# Altium schematic sheet HIenthi.SchDoc
size 508 x 242 mm; SheetNumber: 1; SheetTotal: 1
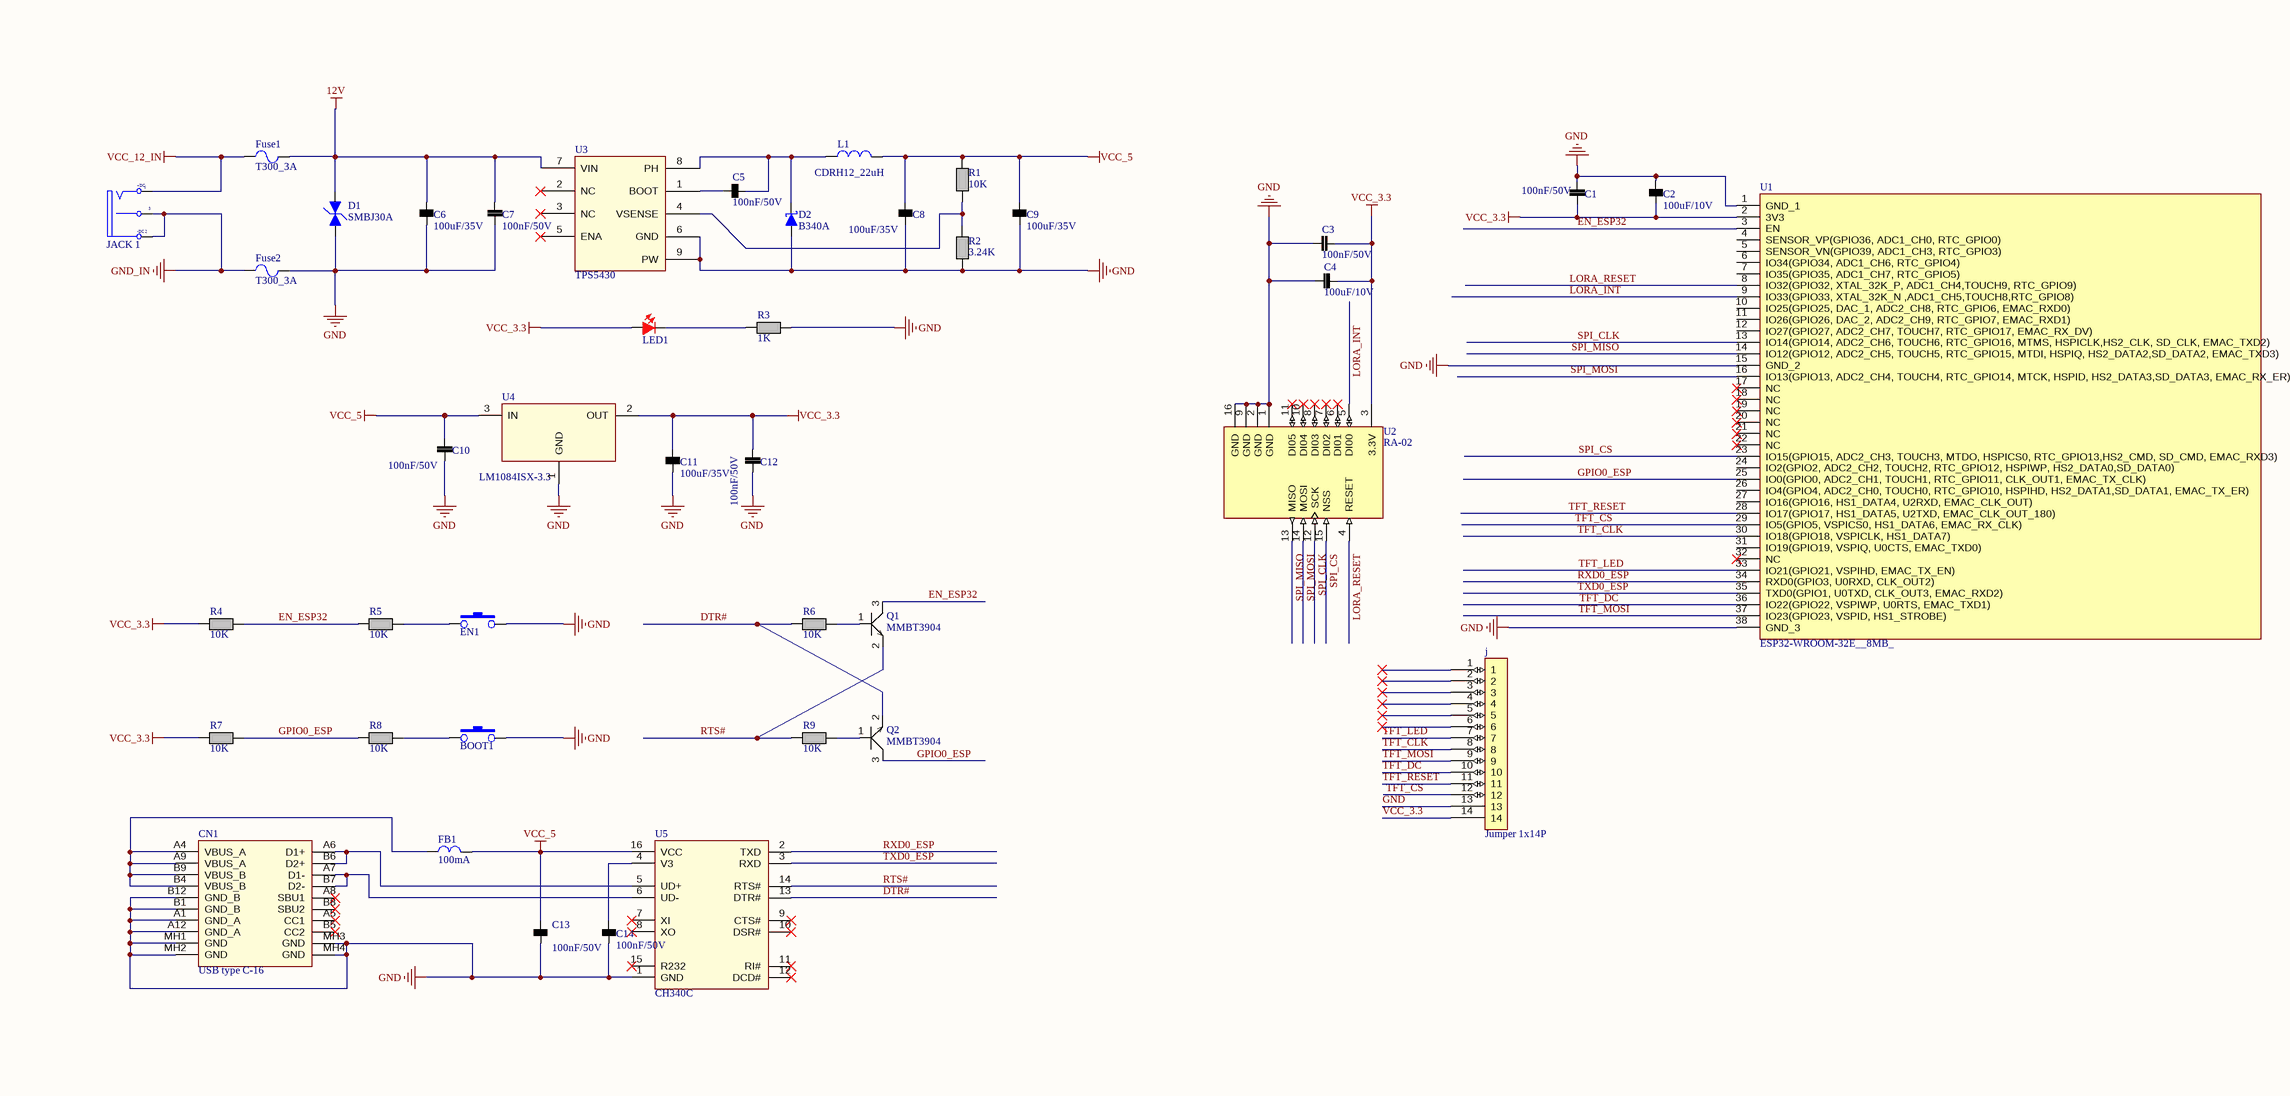
[diagram p0: HIenthi.SchDoc]

## Parts
BOOT1  SW_2pin_SMD  [SW2-SMD**]  (value not drawn)
C1  100nF/50V  [CAP-0805**]
C2  100uF/10V  [CAP_TANTA_SMD3528]
C3  100nF/50V  [CAP-0805**]
C4  100uF/10V  [CAP_TANTA_SMD3528]
C5  100nF/50V  [CAP-0805**]
C6  100uF/35V  [CAP-AL- Size D8_6.3×7.7 mm**]
C7  100nF/50V  [CAP-0805**]
C8  100uF/35V  [CAP-AL- Size D8_6.3×7.7 mm**]
C9  100uF/35V  [CAP-AL- Size D8_6.3×7.7 mm**]
C10  100nF/50V  [CAP-0805**]
C11  100uF/35V  [CAP-AL- Size D8_6.3×7.7 mm**]
C12  100nF/50V  [CAP-0805**]
C13  100nF/50V  [CAP-0805**]
C14  100nF/50V  [CAP-0805**]
CN1  USB type C-16  [USB TYPE C-16**]
D1  SMBJ30A  [DO-214AA**]
D2  B340A  [DO-214AC**]
EN1  SW_2pin_SMD  [SW2-SMD**]  (value not drawn)
FB1  100mA  [FB 0805**]
Fuse1  T300_3A  [FUSE-1812**]
Fuse2  T300_3A  [FUSE-1812**]
j  Jumper 1x14P  [JUMP1x14]
JACK_1  DC3501  [DC_005**]  (value not drawn)
L1  CDRH12_22uH  [IND_CDRH12_12x12x7MM**]
LED1  LedRed  [LED-0805-Red**]  (value not drawn)
Q1  MMBT3904  [SOT23-3 **]
Q2  MMBT3904  [SOT23-3 **]
R1  10K  [Res-0805**]
R2  3.24K  [Res-0805**]
R3  1K  [Res-0805**]
R4  10K  [Res-0805**]
R5  10K  [Res-0805**]
R6  10K  [Res-0805**]
R7  10K  [Res-0805**]
R8  10K  [Res-0805**]
R9  10K  [Res-0805**]
U1  ESP32-WROOM-32E__8MB_  [ESP32WROOM32E8MB]
U2  RA-02  [RA-02]
U3  TPS5430  [SOIC8-PAD**]
U4  LM1084ISX-3.3  [TO-263/D2PAK]
U5  CH340C  [SOIC-16**]

## Nets
12V: C6.1(+) C7.2 D1.2(A) Fuse1.2 U3.7(VIN)
GND: BOOT1.2 C1.2 C2.2(-) C3.1 C4.2(-) C6.2(-) C7.1 C8.2(-) C9.2(-) C10.1 C11.2(-) C12.1 C13.2 C14.2 CN1.A1(GND_A) CN1.A12(GND_A) CN1.B1(GND_B) CN1.B12(GND_B) CN1.MH1(GND) CN1.MH2(GND) CN1.MH3(GND) CN1.MH4(GND) D1.1(A) D2.1(A) EN1.2 Fuse2.2 j.13 R2.1 R3.1 U1.1(GND_1) U1.15(GND_2) U1.38(GND_3) U2.1(GND) U2.2(GND) U2.9(GND) U2.16(GND) U3.6(GND) U3.9(PW) U4.1(GND) U5.1(GND)
GND_IN: Fuse2.1 JACK_1.2(TN) JACK_1.3(S)
VCC_3.3: C1.1 C2.1(+) C3.2 C4.1(+) C11.1(+) C12.2 j.14 LED1.1(A) R4.2 R7.2 U1.2(3V3) U2.3(3.3V) U4.2(OUT)
VCC_5: C8.1(+) C9.1(+) C10.2 C13.1 FB1.2 L1.2 R1.2 U4.3(IN) U5.16(VCC)
VCC_12_IN: Fuse1.1 JACK_1.1(T)
DTR#: Q2.2 R6.2 U5.13(DTR#)
EN_ESP32: Q1.3 R4.1 R5.2 U1.3(EN)
GPIO0_ESP: Q2.3 R7.1 R8.2 U1.25(IO0(GPIO0,_ADC2_CH1,_TOUCH1,_RTC_GPIO11,_CLK_OUT1,_EMAC_TX_CLK))
LORA_INT: U1.9(IO33(GPIO33,_XTAL_32K_N_,ADC1_CH5,TOUCH8,RTC_GPIO8)) U2.5(DI00)
LORA_RESET: U1.8(IO32(GPIO32,_XTAL_32K_P,_ADC1_CH4,TOUCH9,_RTC_GPIO9)) U2.4(RESET)
RTS#: Q1.2 R9.2 U5.14(RTS#)
RXD0_ESP: U1.34(RXD0(GPIO3,_U0RXD,_CLK_OUT2)) U5.2(TXD)
SPI_CLK: U1.13(IO14(GPIO14,_ADC2_CH6,_TOUCH6,_RTC_GPIO16,_MTMS,_HSPICLK,HS2_CLK,_SD_CLK,_EMAC_TXD2)) U2.12(SCK)
SPI_CS: U1.23(IO15(GPIO15,_ADC2_CH3,_TOUCH3,_MTDO,_HSPICS0,_RTC_GPIO13,HS2_CMD,_SD_CMD,_EMAC_RXD3)) U2.15(NSS)
SPI_MISO: U1.14(IO12(GPIO12,_ADC2_CH5,_TOUCH5,_RTC_GPIO15,_MTDI,_HSPIQ,_HS2_DATA2,SD_DATA2,_EMAC_TXD3)) U2.13(MISO)
SPI_MOSI: U1.16(IO13(GPIO13,_ADC2_CH4,_TOUCH4,_RTC_GPIO14,_MTCK,_HSPID,_HS2_DATA3,SD_DATA3,_EMAC_RX_ER)) U2.14(MOSI)
TFT_CLK: j.8 U1.30(IO18(GPIO18,_VSPICLK,_HS1_DATA7))
TFT_CS: j.12 U1.29(IO5(GPIO5,_VSPICS0,_HS1_DATA6,_EMAC_RX_CLK))
TFT_DC: j.10 U1.36(IO22(GPIO22,_VSPIWP,_U0RTS,_EMAC_TXD1))
TFT_LED: j.7 U1.33(IO21(GPIO21,_VSPIHD,_EMAC_TX_EN))
TFT_MOSI: j.9 U1.37(IO23(GPIO23,_VSPID,_HS1_STROBE))
TFT_RESET: j.11 U1.28(IO17(GPIO17,_HS1_DATA5,_U2TXD,_EMAC_CLK_OUT_180))
TXD0_ESP: U1.35(TXD0(GPIO1,_U0TXD,_CLK_OUT3,_EMAC_RXD2)) U5.3(RXD)
NetBOOT1_1: BOOT1.1 R8.1
NetC5_1: C5.1 U3.1(BOOT)
NetC5_2: C5.2 D2.2(K) L1.1 U3.8(PH)
NetC14_1: C14.1 U5.4(V3)
NetCN1_A4: CN1.A4(VBUS_A) CN1.A9(VBUS_A) CN1.B4(VBUS_B) CN1.B9(VBUS_B) FB1.1
NetCN1_A6: CN1.A6(D1+) CN1.B6(D2+) U5.5(UD+)
NetCN1_A7: CN1.A7(D1-) CN1.B7(D2-) U5.6(UD-)
NetEN1_1: EN1.1 R5.1
NetLED1_2: LED1.2(K) R3.2
NetQ1_1: Q1.1 R6.1
NetQ2_1: Q2.1 R9.1
NetR1_1: R1.1 R2.2 U3.4(VSENSE)

Not connected (* = marked no-connect by the designer): CN1 A5(CC1)* A8(SBU1)* B5(CC2)* B8(SBU2)*; j 1* 2* 3* 4* 5* 6*; U1 4(SENSOR_VP(GPIO36,_ADC1_CH0,_RTC_GPIO0)) 5(SENSOR_VN(GPIO39,_ADC1_CH3,_RTC_GPIO3)) 6(IO34(GPIO34,_ADC1_CH6,_RTC_GPIO4)) 7(IO35(GPIO35,_ADC1_CH7,_RTC_GPIO5)) 10(IO25(GPIO25,_DAC_1,_ADC2_CH8,_RTC_GPIO6,_EMAC_RXD0)) 11(IO26(GPIO26,_DAC_2,_ADC2_CH9,_RTC_GPIO7,_EMAC_RXD1)) 12(IO27(GPIO27,_ADC2_CH7,_TOUCH7,_RTC_GPIO17,_EMAC_RX_DV)) 17(NC)* 18(NC)* 19(NC)* 20(NC)* 21(NC)* 22(NC)* 24(IO2(GPIO2,_ADC2_CH2,_TOUCH2,_RTC_GPIO12,_HSPIWP,_HS2_DATA0,SD_DATA0)) 26(IO4(GPIO4,_ADC2_CH0,_TOUCH0,_RTC_GPIO10,_HSPIHD,_HS2_DATA1,SD_DATA1,_EMAC_TX_ER)) 27(IO16(GPIO16,_HS1_DATA4,_U2RXD,_EMAC_CLK_OUT)) 31(IO19(GPIO19,_VSPIQ,_U0CTS,_EMAC_TXD0)) 32(NC)*; U2 6(DI01)* 7(DI02)* 8(DI03)* 10(DI04)* 11(DI05)*; U3 2(NC)* 3(NC)* 5(ENA)*; U5 7(XI)* 8(XO)* 9(CTS#)* 10(DSR#)* 11(RI#)* 12(DCD#)* 15(R232)*

## Notes on the sheet
- (in symbol Jack  DC3501) +DC; -DC

## Library data of the parts
C1 C3 C5 C7 C10 C12-C14 = Cap-100nF/50V_0805: 2Pin-SMD-0805 ,Ceramic X7R; ComponentLink2Description: LINK; ComponentLink2URL: https://detail.tmall.com/item.htm?spm=a230r.1.14.4.26821280N1IkGr&id=14263740089&ns=1&abbucket=13; Supplier 1: Digi-Key; Supplier Part Number 1: 478-5794-1-ND
C2 C4 = Cap-Tanta_100uF/10V 3528: Cap-Tantalum  SMD3528 3.5mm x 2.8mm; ComponentLink1Description: LINK; ComponentLink1URL: https://www.linhkienchatluong.vn/tu-tantalium/tu-tantalum-3528-107a-10v-100uf-35x28mm-tajb107m010rnj_sp460_ct1163.aspx
C6 C8 C9 C11 = Cap-Al_100uF/35V: Cap-Al-Size D8_6.3×7.7 mm; ComponentLink1Description: LINK; ComponentLink1URL: https://detail.tmall.com/item.htm?id=41255381063&ali_refid=a3_430620_1006:1109983619:N:mR14IaEyJGx9IXgn9mrJ8g==:fcc8671f3f0767a2a283883aff17c2c8&ali_trackid=1_fcc8671f3f0767a2a283883aff17c2c8&spm=a230r.1.14.11; Supplier 1: Digi-Key; Supplier Part Number 1: PCE4023CT-ND
CN1 = USB type C-16: MF: Valcon; MP: CSP-USC16-TR; SnapEDA_Link: https://www.snapeda.com/parts/CSP-USC16-TR/Valcon/view-part/?ref=snap; Availability: In Stock; Price: None; Value: *; Check_prices: https://www.snapeda.com/parts/CSP-USC16-TR/Valcon/view-part/?ref=eda; Package: None; Purchase-URL: https://pricing.snapeda.com/search/part/CSP-USC16-TR/?ref=eda
D1 = D-TVS_SMBJ30A: DO-214AA**; Supplier 1: Digi-Key; Supplier Part Number 1: 497-7452-1-ND
D2 = DSchottky_B340A: DO_214AC; Published: 8-Jun-2000; LatestRevisionDate: 17-Jul-2002; LatestRevisionNote: Re-released for DXP Platform.; PackageReference: SMB; Publisher: Altium Limited; PackageDescription: DO-214-AA/SMB; 2 C-Bend Leads; Body 5.3 x 3.6 mm, inc. leads (LxW); Code_JEDEC: DO-214-AA; Supplier 1: Digi-Key; Supplier Part Number 1: B340A-FDICT-ND
FB1 = FB0805/600R_0805: FB0805/600R/0805; Code_IEC: 1005; Value: 600R/100mA; Published: 8-Jun-2000; LatestRevisionDate: 29-May-2009; LatestRevisionNote: IPC-7351 Footprint Added.; PackageReference: 0402-A; Publisher: Altium Limited; PackageDescription: Chip Inductor; Code_JEITA: 0402; ComponentLink1Description: LINK; ComponentLink1URL: https://detail.tmall.com/item.htm?spm=a230r.1.14.19.4d2d4104dPStzc&id=520400456792&ns=1&abbucket=14; Supplier 1: Digi-Key; Supplier Part Number 1: 732-1605-1-ND
Fuse1 Fuse2 = FUSE 3A _1812: SMD 1812; ComponentLink1Description: LINK
JACK_1 = Jack  DC3501: Jack DC3.5x1.3MM DC3501; Value: Jac DC; ComponentLink1Description: LINK; ComponentLink1URL: https://banlinhkien.vn/search.php?encode=YToyOntzOjg6ImtleXdvcmRzIjtzOjc6IiBEQzM1MDEiO3M6MTg6InNlYXJjaF9lbmNvZGVfdGltZSI7aToxNTk1MTMzOTcxO30=
L1 = IN_CDRH12_22uH: CDRH12_12x12x7MM**; Manufacturer: Generic Components; Class: Passive; SubClass: Inductor; Value: 22uH; Published: 08/06/2000; Publisher: Altium Hobart Technology Centre; ComponentLink1Description: LINK; ComponentLink1URL: https://detail.tmall.com/item.htm?spm=a230r.1.14.4.22082c55KfJoCj&id=611579782762&ns=1&abbucket=13
LED1 = LedRed: 2Pin-SMD
Q1 Q2 = TRA-N_MMBT3904: 3PIN-SOT23,MMBT3904; ComponentLink1Description: LINK; ComponentLink1URL: https://item.taobao.com/item.htm?id=527006583092&ali_refid=a3_430620_1006:1121200726:N:XI%2BpTmT8xw9bZIeM%2FjTiLA%3D%3D:19dd16769967fd6e0912d0270aacb09b&ali_trackid=1_19dd16769967fd6e0912d0270aacb09b&spm=a230r.1.14.6#detail
R1 R4-R9 = Res-10K 0805 SMD: Supplier 1: Digi-Key; Supplier Part Number 1: P2.2KADCT-ND; ComponentLink1Description: LINK; ComponentLink1URL: https://item.taobao.com/item.htm?id=9650284639&ali_refid=a3_430620_1006:1103178945:N:UGPSVTFPMeU0i498yOmUJg%3D%3D:a0464737d977578f179f11ed5bc90629&ali_trackid=1_a0464737d977578f179f11ed5bc90629&spm=a230r.1.14.3#detail
R2 = Res-3.24K 0805 SMD: Supplier 1: Digi-Key; Supplier Part Number 1: P2.2KADCT-ND; ComponentLink1Description: New link; ComponentLink1URL: https://detail.tmall.com/item.htm?spm=a230r.1.14.40.76941cc8lWAt5G&id=601599239036&ns=1&abbucket=13&skuId=4207155181076
R3 = Res-1K 0805 SMD: ComponentLink1Description: LINK; ComponentLink1URL: https://detail.tmall.com/item.htm?spm=a230r.1.14.11.52f63c9f5M7ld0&id=590284119473&ns=1&abbucket=18; Supplier 1: Digi-Key; Supplier Part Number 1: 311-1.00KCRDKR-ND
U1 = ESP32-WROOM-32E__8MB_: Integrated Circuit; Manufacturer_Name: Espressif Systems; Manufacturer_Part_Number: ESP32-WROOM-32E (8MB); Datasheet Link: https://www.espressif.com/sites/default/files/documentation/esp32-wroom-32_datasheet_en.pdf; Height: 3.2mm; Mouser Part Number: 356-ESP32WRM32E164PH; Mouser Price/Stock: https://www.mouser.co.uk/ProductDetail/Espressif-Systems/ESP32-WROOM-32E-8MB?qs=GBLSl2AkirsjshqvD9slKA%3D%3D
U2 = RA-02: General ISM < 1GHz LoRaâ„¢ Transceiver Module 410MHz ~ 525MHz Antenna Not Included, I-PEX Surface Mount; MF: Ai-Thinker; SnapEDA_Link: https://www.snapeda.com/parts/RA-02/AI-Thinker/view-part/?ref=snap; Package: None; Value: *; MP: RA-02; Check_prices: https://www.snapeda.com/parts/RA-02/AI-Thinker/view-part/?ref=eda
U3 = TPS5430: SOIC8 pad-Height 1.7mm; ComponentLink1Description: LINK; ComponentLink1URL: https://item.taobao.com/item.htm?id=575547225646&ali_refid=a3_430620_1006:1157180137:N:TqzOo3Qsw2wJKBie%2FoCIZA%3D%3D:72b2137211524287db0a57c77fec9fe5&ali_trackid=1_72b2137211524287db0a57c77fec9fe5&spm=a230r.1.14.3#detail; Supplier 1: Digi-Key; Supplier Part Number 1: 296-19447-5-ND
U4 = LM1084ISX-3.3: TO263-3
U5 = CH340C: 16Pin-SOIC; ComponentLink1Description: LINK; ComponentLink1URL: https://item.taobao.com/item.htm?id=639554726734&ali_refid=a3_430620_1006:1261900192:N:GznzMacpvOVvv07TLoCAYw%3D%3D:7282688349290e4dc0857049d96b4ef9&ali_trackid=1_7282688349290e4dc0857049d96b4ef9&spm=a230r.1.14.6#detail
BOOT1 EN1 = SW_2pin_SMD: ComponentLink1Description: LINK; ComponentLink1URL: https://www.linhkienchatluong.vn/nut-nhan-sieu-nho/nut-nhan-2-chan-dan-3x6x25mm-loai-tot-dong-day-10c_sp849_ct1800.aspx
j = Jumper 1x14P: ComponentLink1Description: New link; ComponentLink1URL: *